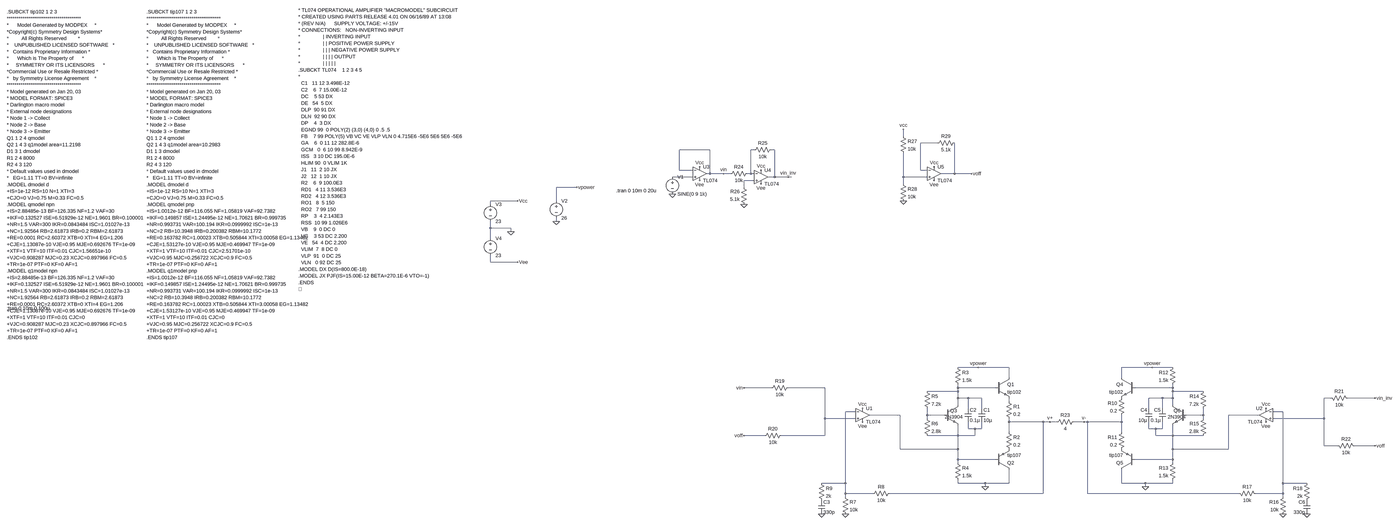
[diagram p0: schematic Draft1.asc, whole sheet]
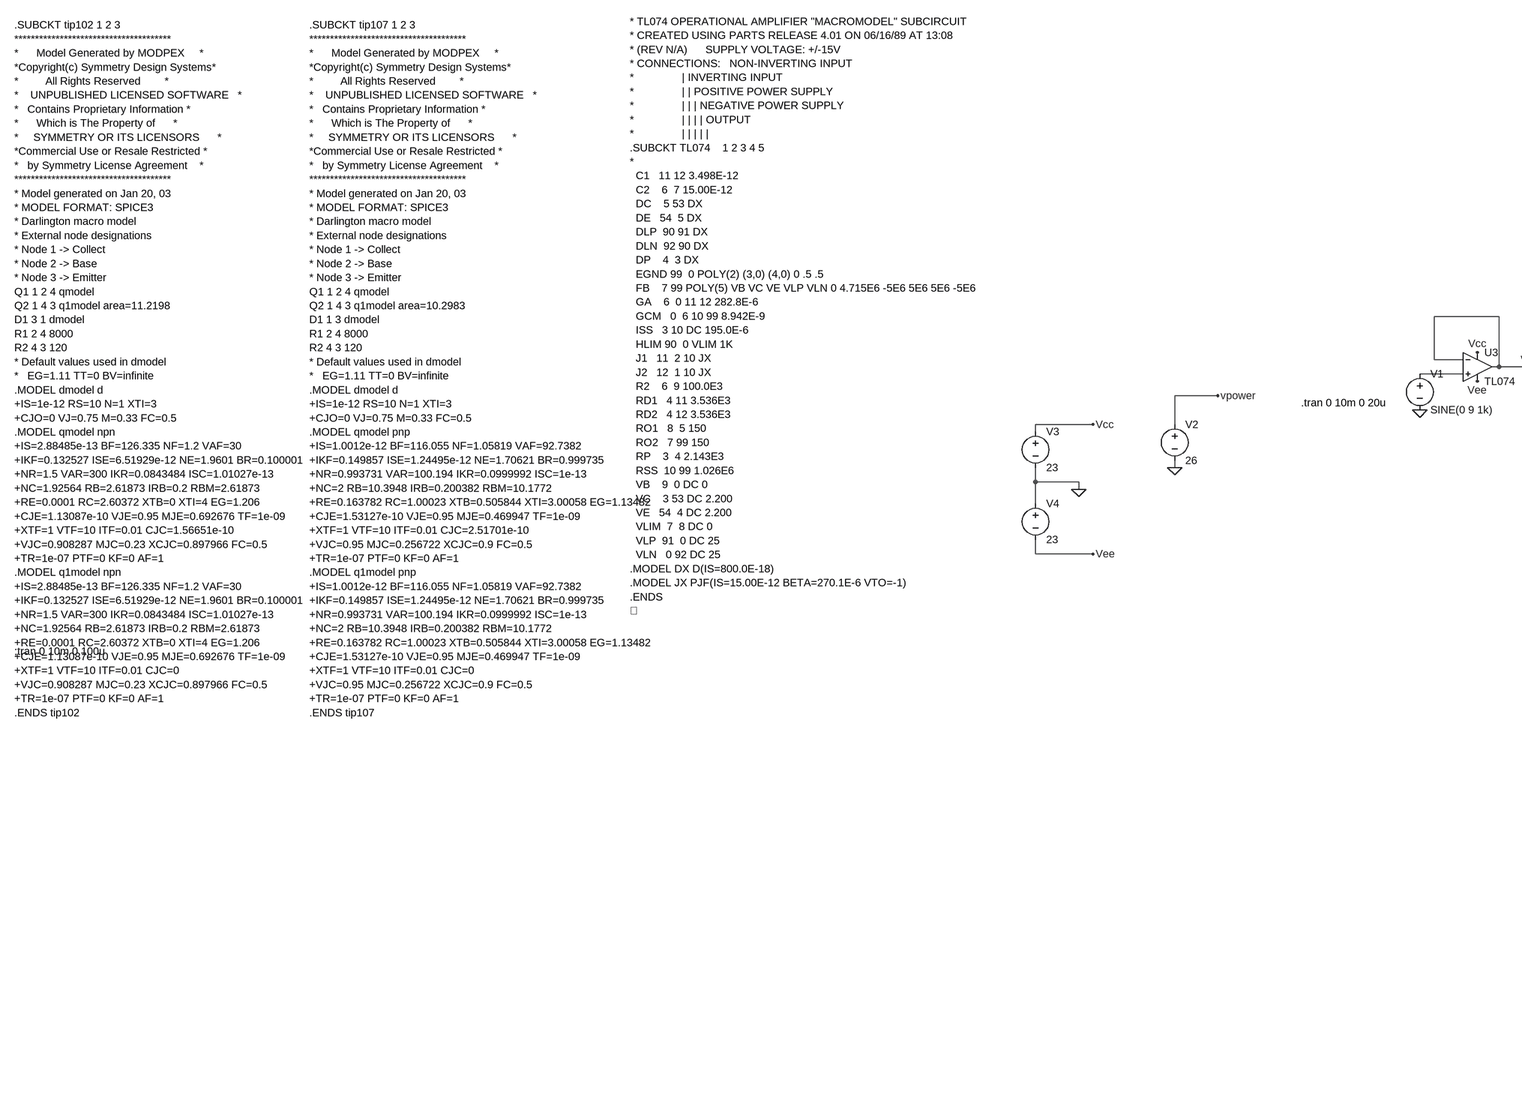
[diagram p1: schematic Draft1.asc, part, row 1 of 1, column 1 of 2]
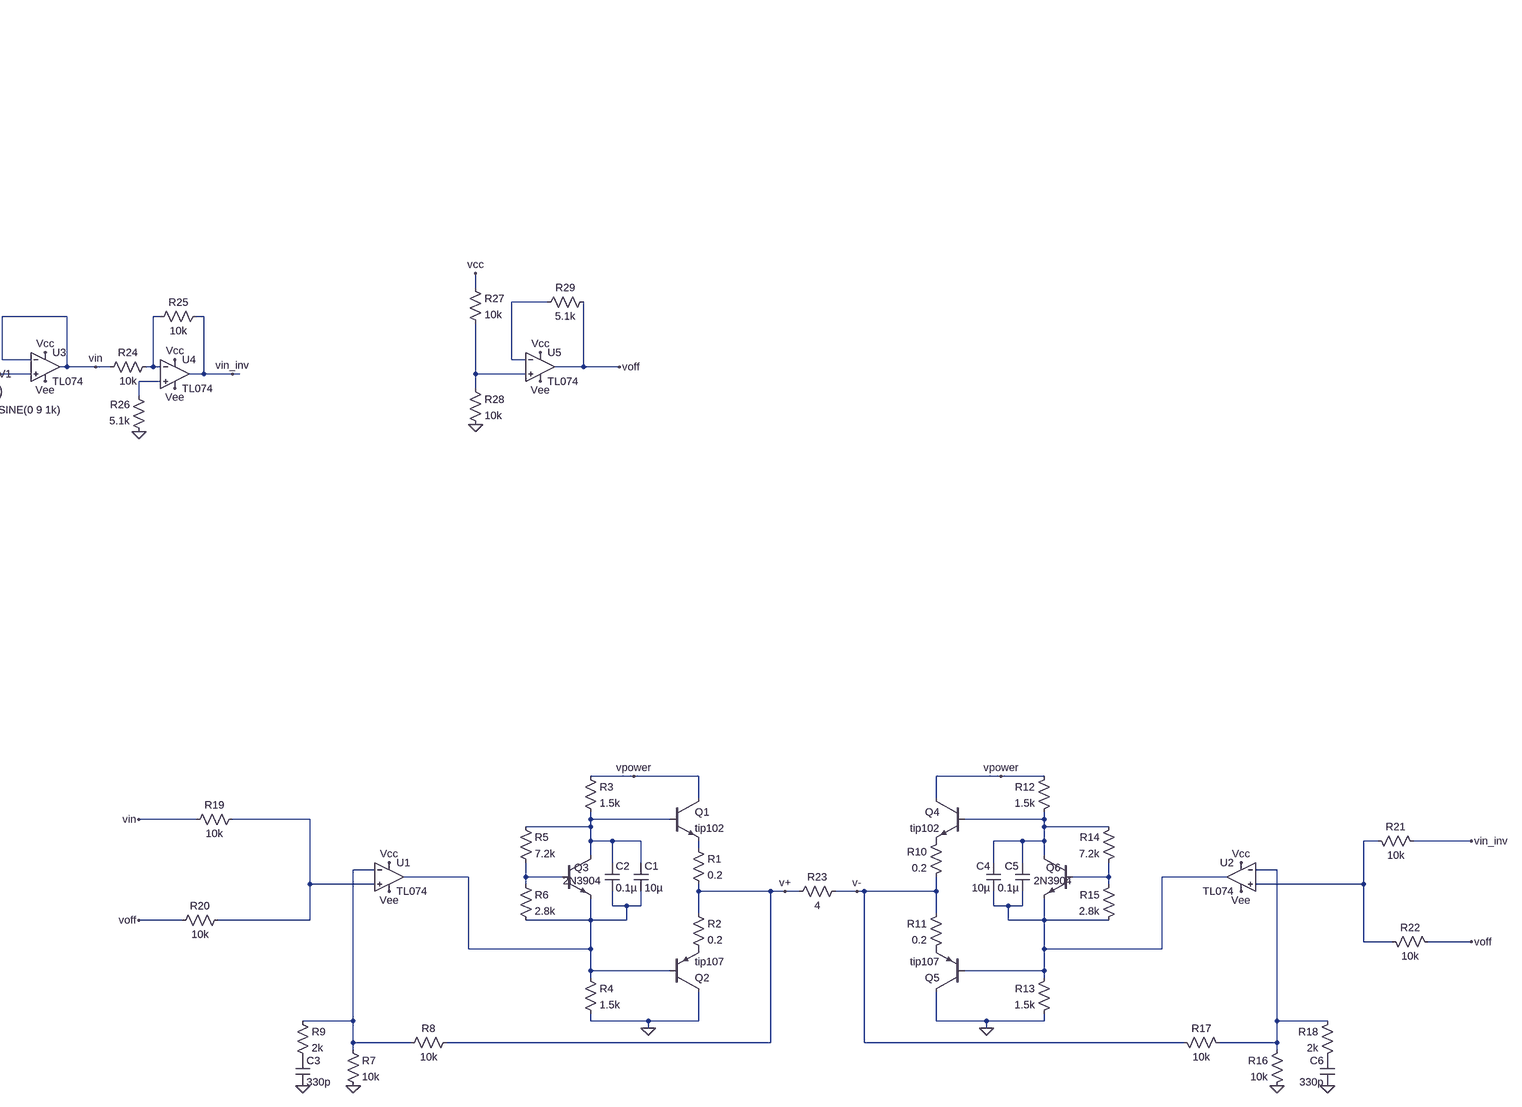
[diagram p2: schematic Draft1.asc, part, row 1 of 1, column 2 of 2]
Draft1.asc, the LTspice schematic file:
Version 4
SHEET 1 2456 680
WIRE 128 -1568 128 -1600
WIRE 288 -1536 208 -1536
WIRE -832 -1504 -976 -1504
WIRE -624 -1504 -640 -1504
WIRE -528 -1504 -544 -1504
WIRE -976 -1408 -976 -1504
WIRE -912 -1408 -976 -1408
WIRE 208 -1408 208 -1536
WIRE 240 -1408 208 -1408
WIRE -832 -1392 -832 -1504
WIRE -832 -1392 -848 -1392
WIRE -768 -1392 -832 -1392
WIRE -736 -1392 -768 -1392
WIRE -640 -1392 -640 -1504
WIRE -640 -1392 -656 -1392
WIRE -624 -1392 -640 -1392
WIRE 368 -1392 368 -1536
WIRE 368 -1392 304 -1392
WIRE 448 -1392 368 -1392
WIRE -912 -1376 -1008 -1376
WIRE -528 -1376 -528 -1504
WIRE -528 -1376 -560 -1376
WIRE -464 -1376 -528 -1376
WIRE -448 -1376 -464 -1376
WIRE 128 -1376 128 -1488
WIRE 240 -1376 128 -1376
WIRE -624 -1360 -672 -1360
WIRE 128 -1344 128 -1376
WIRE -2192 -1328 -2288 -1328
WIRE -672 -1328 -672 -1360
WIRE -2576 -1264 -2704 -1264
WIRE -2288 -1264 -2288 -1328
WIRE -2704 -1248 -2704 -1264
WIRE -2288 -1168 -2288 -1184
WIRE -2704 -1136 -2704 -1168
WIRE -2608 -1136 -2704 -1136
WIRE -2608 -1120 -2608 -1136
WIRE -2704 -1088 -2704 -1136
WIRE -2704 -976 -2704 -1008
WIRE -2576 -976 -2704 -976
WIRE 480 -432 384 -432
WIRE 624 -432 480 -432
WIRE 1296 -432 1152 -432
WIRE 1392 -432 1296 -432
WIRE 624 -384 624 -432
WIRE 1152 -384 1152 -432
WIRE -544 -336 -672 -336
WIRE -240 -336 -464 -336
WIRE 384 -336 384 -352
WIRE 560 -336 384 -336
WIRE 1392 -336 1392 -352
WIRE 1392 -336 1216 -336
WIRE 384 -320 384 -336
WIRE 384 -320 240 -320
WIRE 1392 -320 1392 -336
WIRE 1536 -320 1392 -320
WIRE 384 -288 384 -320
WIRE 432 -288 384 -288
WIRE 496 -288 432 -288
WIRE 1344 -288 1280 -288
WIRE 1392 -288 1392 -320
WIRE 1392 -288 1344 -288
WIRE 2144 -288 2112 -288
WIRE 2352 -288 2224 -288
WIRE 624 -272 624 -288
WIRE 384 -256 384 -288
WIRE 1392 -256 1392 -288
WIRE 432 -240 432 -288
WIRE 496 -240 496 -288
WIRE 1280 -240 1280 -288
WIRE 1344 -240 1344 -288
WIRE -96 -224 -144 -224
WIRE 1920 -224 1872 -224
WIRE 112 -208 -32 -208
WIRE 240 -208 240 -240
WIRE 320 -208 240 -208
WIRE 1536 -208 1536 -240
WIRE 1536 -208 1456 -208
WIRE 1808 -208 1664 -208
WIRE -240 -192 -240 -336
WIRE -96 -192 -240 -192
WIRE 240 -192 240 -208
WIRE 1536 -192 1536 -208
WIRE 2112 -192 2112 -288
WIRE 2112 -192 1872 -192
WIRE 624 -176 624 -192
WIRE 784 -176 624 -176
WIRE 816 -176 784 -176
WIRE 848 -176 816 -176
WIRE 976 -176 928 -176
WIRE 992 -176 976 -176
WIRE 1152 -176 1152 -208
WIRE 1152 -176 992 -176
WIRE 432 -144 432 -176
WIRE 464 -144 432 -144
WIRE 496 -144 496 -176
WIRE 496 -144 464 -144
WIRE 1280 -144 1280 -176
WIRE 1312 -144 1280 -144
WIRE 1344 -144 1344 -176
WIRE 1344 -144 1312 -144
WIRE 624 -128 624 -176
WIRE 1152 -128 1152 -176
WIRE -576 -112 -672 -112
WIRE -240 -112 -240 -192
WIRE -240 -112 -496 -112
WIRE 384 -112 384 -160
WIRE 384 -112 240 -112
WIRE 464 -112 464 -144
WIRE 464 -112 384 -112
WIRE 1312 -112 1312 -144
WIRE 1392 -112 1392 -160
WIRE 1392 -112 1312 -112
WIRE 1536 -112 1392 -112
WIRE 2112 -64 2112 -192
WIRE 2176 -64 2112 -64
WIRE 2352 -64 2256 -64
WIRE 112 -48 112 -208
WIRE 384 -48 384 -112
WIRE 384 -48 112 -48
WIRE 1392 -48 1392 -112
WIRE 1664 -48 1664 -208
WIRE 1664 -48 1392 -48
WIRE 384 0 384 -48
WIRE 560 0 384 0
WIRE 1392 0 1392 -48
WIRE 1392 0 1216 0
WIRE 384 16 384 0
WIRE 1392 16 1392 0
WIRE -144 112 -144 -224
WIRE -144 112 -256 112
WIRE 384 112 384 96
WIRE 512 112 384 112
WIRE 624 112 624 48
WIRE 624 112 512 112
WIRE 1152 112 1152 48
WIRE 1264 112 1152 112
WIRE 1392 112 1392 96
WIRE 1392 112 1264 112
WIRE 1920 112 1920 -224
WIRE 2032 112 1920 112
WIRE 512 128 512 112
WIRE 1264 128 1264 112
WIRE -144 160 -144 112
WIRE -16 160 -144 160
WIRE 784 160 784 -176
WIRE 784 160 64 160
WIRE 992 160 992 -176
WIRE 1712 160 992 160
WIRE 1920 160 1920 112
WIRE 1920 160 1792 160
WIRE -144 176 -144 160
WIRE 1920 176 1920 160
FLAG -64 -240 Vcc
FLAG -64 -176 Vee
FLAG -144 256 0
FLAG -256 256 0
FLAG 480 -432 vpower
FLAG 512 128 0
FLAG 1840 -240 Vcc
FLAG 1840 -176 Vee
FLAG 1920 256 0
FLAG 2032 256 0
FLAG 1296 -432 vpower
FLAG 1264 128 0
FLAG -672 -112 voff
FLAG 2352 -64 voff
FLAG 2352 -288 vin_inv
FLAG -672 -336 vin
FLAG 816 -176 v+
FLAG 976 -176 v-
FLAG -880 -1424 Vcc
FLAG -880 -1360 Vee
FLAG -592 -1408 Vcc
FLAG -592 -1344 Vee
FLAG -672 -1248 0
FLAG -768 -1392 vin
FLAG -464 -1376 vin_inv
FLAG 272 -1424 Vcc
FLAG 272 -1360 Vee
FLAG 128 -1264 0
FLAG 128 -1600 vcc
FLAG 448 -1392 voff
FLAG -1008 -1296 0
FLAG -2608 -1120 0
FLAG -2576 -1264 Vcc
FLAG -2576 -976 Vee
FLAG -2288 -1168 0
FLAG -2192 -1328 vpower
SYMBOL npn 560 -384 R0
SYMATTR InstName Q1
SYMATTR Value tip102
SYMATTR Prefix X
SYMBOL pnp 560 48 M180
SYMATTR InstName Q2
SYMATTR Value tip107
SYMATTR Prefix X
SYMBOL res 608 -288 R0
SYMATTR InstName R1
SYMATTR Value 0.2
SYMBOL res 608 -144 R0
SYMATTR InstName R2
SYMATTR Value 0.2
SYMBOL res 368 -448 R0
SYMATTR InstName R3
SYMATTR Value 1.5k
SYMBOL res 368 0 R0
SYMATTR InstName R4
SYMATTR Value 1.5k
SYMBOL OpAmps\\opamp2 -64 -272 R0
SYMATTR InstName U1
SYMATTR Value TL074
SYMBOL npn 320 -256 R0
WINDOW 0 27 27 Left 2
WINDOW 3 2 56 Left 2
SYMATTR InstName Q3
SYMATTR Value 2N3904
SYMBOL res 224 -336 R0
SYMATTR InstName R5
SYMATTR Value 7.2k
SYMBOL res 224 -208 R0
SYMATTR InstName R6
SYMATTR Value 2.8k
SYMBOL cap 480 -240 R0
SYMATTR InstName C1
SYMATTR Value 10µ
SYMBOL cap 416 -240 R0
SYMATTR InstName C2
SYMATTR Value 0.1µ
SYMBOL res -160 160 R0
SYMATTR InstName R7
SYMATTR Value 10k
SYMBOL res 80 144 R90
WINDOW 0 0 56 VBottom 2
WINDOW 3 32 56 VTop 2
SYMATTR InstName R8
SYMATTR Value 10k
SYMBOL res -272 96 R0
SYMATTR InstName R9
SYMATTR Value 2k
SYMBOL cap -272 192 R0
SYMATTR InstName C3
SYMATTR Value 330p
SYMBOL npn 1216 -384 M0
SYMATTR InstName Q4
SYMATTR Value tip102
SYMATTR Prefix X
SYMBOL pnp 1216 48 R180
SYMATTR InstName Q5
SYMATTR Value tip107
SYMATTR Prefix X
SYMBOL res 1168 -304 M0
SYMATTR InstName R10
SYMATTR Value 0.2
SYMBOL res 1168 -144 M0
SYMATTR InstName R11
SYMATTR Value 0.2
SYMBOL res 1408 -448 M0
SYMATTR InstName R12
SYMATTR Value 1.5k
SYMBOL res 1408 0 M0
SYMATTR InstName R13
SYMATTR Value 1.5k
SYMBOL OpAmps\\opamp2 1840 -272 M0
SYMATTR InstName U2
SYMATTR Value TL074
SYMBOL npn 1456 -256 M0
WINDOW 0 27 27 Left 2
WINDOW 3 2 56 Left 2
SYMATTR InstName Q6
SYMATTR Value 2N3904
SYMBOL res 1552 -336 M0
SYMATTR InstName R14
SYMATTR Value 7.2k
SYMBOL res 1552 -208 M0
SYMATTR InstName R15
SYMATTR Value 2.8k
SYMBOL cap 1296 -240 M0
SYMATTR InstName C4
SYMATTR Value 10µ
SYMBOL cap 1360 -240 M0
SYMATTR InstName C5
SYMATTR Value 0.1µ
SYMBOL res 1936 160 M0
SYMATTR InstName R16
SYMATTR Value 10k
SYMBOL res 1696 144 M90
WINDOW 0 0 56 VBottom 2
WINDOW 3 32 56 VTop 2
SYMATTR InstName R17
SYMATTR Value 10k
SYMBOL res 2048 96 M0
SYMATTR InstName R18
SYMATTR Value 2k
SYMBOL cap 2048 192 M0
SYMATTR InstName C6
SYMATTR Value 330p
SYMBOL res -448 -352 R90
WINDOW 0 0 56 VBottom 2
WINDOW 3 32 56 VTop 2
SYMATTR InstName R19
SYMATTR Value 10k
SYMBOL res -480 -128 R90
WINDOW 0 0 56 VBottom 2
WINDOW 3 32 56 VTop 2
SYMATTR InstName R20
SYMATTR Value 10k
SYMBOL res 2128 -304 M90
WINDOW 0 0 56 VBottom 2
WINDOW 3 32 56 VTop 2
SYMATTR InstName R21
SYMATTR Value 10k
SYMBOL res 2160 -80 M90
WINDOW 0 0 56 VBottom 2
WINDOW 3 32 56 VTop 2
SYMATTR InstName R22
SYMATTR Value 10k
SYMBOL res 944 -192 R90
WINDOW 0 0 56 VBottom 2
WINDOW 3 32 56 VTop 2
SYMATTR InstName R23
SYMATTR Value 4
SYMBOL OpAmps\\opamp2 -880 -1456 R0
SYMATTR InstName U3
SYMATTR Value TL074
SYMBOL OpAmps\\opamp2 -592 -1440 R0
SYMATTR InstName U4
SYMATTR Value TL074
SYMBOL res -640 -1408 R90
WINDOW 0 0 56 VBottom 2
WINDOW 3 32 56 VTop 2
SYMATTR InstName R24
SYMATTR Value 10k
SYMBOL res -528 -1520 R90
WINDOW 0 0 56 VBottom 2
WINDOW 3 32 56 VTop 2
SYMATTR InstName R25
SYMATTR Value 10k
SYMBOL res -656 -1232 R180
WINDOW 0 36 76 Left 2
WINDOW 3 36 40 Left 2
SYMATTR InstName R26
SYMATTR Value 5.1k
SYMBOL OpAmps\\opamp2 272 -1456 R0
SYMATTR InstName U5
SYMATTR Value TL074
SYMBOL res 112 -1584 R0
SYMATTR InstName R27
SYMATTR Value 10k
SYMBOL res 112 -1360 R0
SYMATTR InstName R28
SYMATTR Value 10k
SYMBOL res 384 -1552 R90
WINDOW 0 0 56 VBottom 2
WINDOW 3 32 56 VTop 2
SYMATTR InstName R29
SYMATTR Value 5.1k
SYMBOL voltage -1008 -1392 R0
WINDOW 123 0 0 Left 0
WINDOW 39 0 0 Left 0
SYMATTR InstName V1
SYMATTR Value SINE(0 9 1k)
SYMBOL voltage -2288 -1280 R0
WINDOW 123 0 0 Left 0
WINDOW 39 0 0 Left 0
SYMATTR InstName V2
SYMATTR Value 26
SYMBOL voltage -2704 -1264 R0
WINDOW 123 0 0 Left 0
WINDOW 39 0 0 Left 0
SYMATTR InstName V3
SYMATTR Value 23
SYMBOL voltage -2704 -1104 R0
WINDOW 123 0 0 Left 0
WINDOW 39 0 0 Left 0
SYMATTR InstName V4
SYMATTR Value 23
TEXT -1272 -1312 Left 2 !.tran 0 10m 0 20u
TEXT -5696 -2152 Left 2 !.SUBCKT tip102 1 2 3\n**************************************\n*      Model Generated by MODPEX     *\n*Copyright(c) Symmetry Design Systems*\n*         All Rights Reserved        *\n*    UNPUBLISHED LICENSED SOFTWARE   *\n*   Contains Proprietary Information *\n*      Which is The Property of      *\n*     SYMMETRY OR ITS LICENSORS      *\n*Commercial Use or Resale Restricted *\n*   by Symmetry License Agreement    *\n**************************************\n* Model generated on Jan 20, 03\n* MODEL FORMAT: SPICE3\n* Darlington macro model\n* External node designations\n* Node 1 -> Collect\n* Node 2 -> Base\n* Node 3 -> Emitter\nQ1 1 2 4 qmodel\nQ2 1 4 3 q1model area=11.2198\nD1 3 1 dmodel\nR1 2 4 8000\nR2 4 3 120\n* Default values used in dmodel\n*   EG=1.11 TT=0 BV=infinite\n.MODEL dmodel d\n+IS=1e-12 RS=10 N=1 XTI=3\n+CJO=0 VJ=0.75 M=0.33 FC=0.5\n.MODEL qmodel npn\n+IS=2.88485e-13 BF=126.335 NF=1.2 VAF=30\n+IKF=0.132527 ISE=6.51929e-12 NE=1.9601 BR=0.100001\n+NR=1.5 VAR=300 IKR=0.0843484 ISC=1.01027e-13\n+NC=1.92564 RB=2.61873 IRB=0.2 RBM=2.61873\n+RE=0.0001 RC=2.60372 XTB=0 XTI=4 EG=1.206\n+CJE=1.13087e-10 VJE=0.95 MJE=0.692676 TF=1e-09\n+XTF=1 VTF=10 ITF=0.01 CJC=1.56651e-10\n+VJC=0.908287 MJC=0.23 XCJC=0.897966 FC=0.5\n+TR=1e-07 PTF=0 KF=0 AF=1\n.MODEL q1model npn\n+IS=2.88485e-13 BF=126.335 NF=1.2 VAF=30\n+IKF=0.132527 ISE=6.51929e-12 NE=1.9601 BR=0.100001\n+NR=1.5 VAR=300 IKR=0.0843484 ISC=1.01027e-13\n+NC=1.92564 RB=2.61873 IRB=0.2 RBM=2.61873\n+RE=0.0001 RC=2.60372 XTB=0 XTI=4 EG=1.206\n+CJE=1.13087e-10 VJE=0.95 MJE=0.692676 TF=1e-09\n+XTF=1 VTF=10 ITF=0.01 CJC=0\n+VJC=0.908287 MJC=0.23 XCJC=0.897966 FC=0.5\n+TR=1e-07 PTF=0 KF=0 AF=1\n.ENDS tip102
TEXT -5040 -2152 Left 2 !.SUBCKT tip107 1 2 3\n**************************************\n*      Model Generated by MODPEX     *\n*Copyright(c) Symmetry Design Systems*\n*         All Rights Reserved        *\n*    UNPUBLISHED LICENSED SOFTWARE   *\n*   Contains Proprietary Information *\n*      Which is The Property of      *\n*     SYMMETRY OR ITS LICENSORS      *\n*Commercial Use or Resale Restricted *\n*   by Symmetry License Agreement    *\n**************************************\n* Model generated on Jan 20, 03\n* MODEL FORMAT: SPICE3\n* Darlington macro model\n* External node designations\n* Node 1 -> Collect\n* Node 2 -> Base\n* Node 3 -> Emitter\nQ1 1 2 4 qmodel\nQ2 1 4 3 q1model area=10.2983\nD1 1 3 dmodel\nR1 2 4 8000\nR2 4 3 120\n* Default values used in dmodel\n*   EG=1.11 TT=0 BV=infinite\n.MODEL dmodel d\n+IS=1e-12 RS=10 N=1 XTI=3\n+CJO=0 VJ=0.75 M=0.33 FC=0.5\n.MODEL qmodel pnp\n+IS=1.0012e-12 BF=116.055 NF=1.05819 VAF=92.7382\n+IKF=0.149857 ISE=1.24495e-12 NE=1.70621 BR=0.999735\n+NR=0.993731 VAR=100.194 IKR=0.0999992 ISC=1e-13\n+NC=2 RB=10.3948 IRB=0.200382 RBM=10.1772\n+RE=0.163782 RC=1.00023 XTB=0.505844 XTI=3.00058 EG=1.13482\n+CJE=1.53127e-10 VJE=0.95 MJE=0.469947 TF=1e-09\n+XTF=1 VTF=10 ITF=0.01 CJC=2.51701e-10\n+VJC=0.95 MJC=0.256722 XCJC=0.9 FC=0.5\n+TR=1e-07 PTF=0 KF=0 AF=1\n.MODEL q1model pnp\n+IS=1.0012e-12 BF=116.055 NF=1.05819 VAF=92.7382\n+IKF=0.149857 ISE=1.24495e-12 NE=1.70621 BR=0.999735\n+NR=0.993731 VAR=100.194 IKR=0.0999992 ISC=1e-13\n+NC=2 RB=10.3948 IRB=0.200382 RBM=10.1772\n+RE=0.163782 RC=1.00023 XTB=0.505844 XTI=3.00058 EG=1.13482\n+CJE=1.53127e-10 VJE=0.95 MJE=0.469947 TF=1e-09\n+XTF=1 VTF=10 ITF=0.01 CJC=0\n+VJC=0.95 MJC=0.256722 XCJC=0.9 FC=0.5\n+TR=1e-07 PTF=0 KF=0 AF=1\n.ENDS tip107
TEXT -5696 -760 Left 2 !;tran 0 10m 0 100u
TEXT -4328 -2160 Left 2 !* TL074 OPERATIONAL AMPLIFIER "MACROMODEL" SUBCIRCUIT\n* CREATED USING PARTS RELEASE 4.01 ON 06/16/89 AT 13:08\n* (REV N/A)      SUPPLY VOLTAGE: +/-15V\n* CONNECTIONS:   NON-INVERTING INPUT\n*                | INVERTING INPUT\n*                | | POSITIVE POWER SUPPLY\n*                | | | NEGATIVE POWER SUPPLY\n*                | | | | OUTPUT\n*                | | | | |\n.SUBCKT TL074    1 2 3 4 5\n*\n  C1   11 12 3.498E-12\n  C2    6  7 15.00E-12\n  DC    5 53 DX\n  DE   54  5 DX\n  DLP  90 91 DX\n  DLN  92 90 DX\n  DP    4  3 DX\n  EGND 99  0 POLY(2) (3,0) (4,0) 0 .5 .5\n  FB    7 99 POLY(5) VB VC VE VLP VLN 0 4.715E6 -5E6 5E6 5E6 -5E6\n  GA    6  0 11 12 282.8E-6\n  GCM   0  6 10 99 8.942E-9\n  ISS   3 10 DC 195.0E-6\n  HLIM 90  0 VLIM 1K\n  J1   11  2 10 JX\n  J2   12  1 10 JX\n  R2    6  9 100.0E3\n  RD1   4 11 3.536E3\n  RD2   4 12 3.536E3\n  RO1   8  5 150\n  RO2   7 99 150\n  RP    3  4 2.143E3\n  RSS  10 99 1.026E6\n  VB    9  0 DC 0\n  VC    3 53 DC 2.200\n  VE   54  4 DC 2.200\n  VLIM  7  8 DC 0\n  VLP  91  0 DC 25\n  VLN   0 92 DC 25\n.MODEL DX D(IS=800.0E-18)\n.MODEL JX PJF(IS=15.00E-12 BETA=270.1E-6 VTO=-1)\n.ENDS\n

The netlist it stands for:
* Draft1.asc
XQ1 vpower N007 N010 tip102  ; pins C B E
XQ2 0 N013 P001 tip107  ; pins C B E
R1 N010 v+ 0.2
R2 v+ P001 0.2
R3 vpower N007 1.5k
R4 N013 0 1.5k
XU1 N006 N011 Vcc Vee N013 TL074  ; pins In+ In- V+ V- OUT
Q3 N007 N014 N013 0 2N3904
R5 N007 N014 7.2k
R6 N014 N013 2.8k
C1 N007 N013 10µ
C2 N007 N013 0.1µ
R7 N011 0 10k
R8 v+ N011 10k
R9 N011 P002 2k
C3 P002 0 330p
XQ4 vpower N008 P003 tip102  ; pins C B E
XQ5 0 N016 P004 tip107  ; pins C B E
R10 P003 v- 0.2
R11 v- P004 0.2
R12 vpower N008 1.5k
R13 N016 0 1.5k
XU2 N009 N012 Vcc Vee N016 TL074  ; pins In+ In- V+ V- OUT
Q6 N008 N015 N016 0 2N3904
R14 N008 N015 7.2k
R15 N015 N016 2.8k
C4 N008 N016 10µ
C5 N008 N016 0.1µ
R16 N012 0 10k
R17 v- N012 10k
R18 N012 P005 2k
C6 P005 0 330p
R19 N006 vin 10k
R20 N006 voff 10k
R21 N009 vin_inv 10k
R22 N009 voff 10k
R23 v- v+ 4
XU3 N003 vin Vcc Vee vin TL074  ; pins In+ In- V+ V- OUT
XU4 N005 N002 Vcc Vee vin_inv TL074  ; pins In+ In- V+ V- OUT
R24 N002 vin 10k
R25 vin_inv N002 10k
R26 0 N005 5.1k
XU5 N004 N001 Vcc Vee voff TL074  ; pins In+ In- V+ V- OUT
R27 Vcc N004 10k
R28 N004 0 10k
R29 voff N001 5.1k
V1 N003 0 SINE(0 9 1k)
V2 vpower 0 26
V3 Vcc 0 23
V4 0 Vee 23
.model NPN NPN
.model PNP PNP
.lib standard.bjt
.tran 0 10m 0 20u
.SUBCKT tip102 1 2 3
**************************************
*      Model Generated by MODPEX     *
*Copyright(c) Symmetry Design Systems*
*         All Rights Reserved        *
*    UNPUBLISHED LICENSED SOFTWARE   *
*   Contains Proprietary Information *
*      Which is The Property of      *
*     SYMMETRY OR ITS LICENSORS      *
*Commercial Use or Resale Restricted *
*   by Symmetry License Agreement    *
**************************************
* Model generated on Jan 20, 03
* MODEL FORMAT: SPICE3
* Darlington macro model
* External node designations
* Node 1 -> Collect
* Node 2 -> Base
* Node 3 -> Emitter
Q1 1 2 4 qmodel
Q2 1 4 3 q1model area=11.2198
D1 3 1 dmodel
R1 2 4 8000
R2 4 3 120
* Default values used in dmodel
*   EG=1.11 TT=0 BV=infinite
.MODEL dmodel d
+IS=1e-12 RS=10 N=1 XTI=3
+CJO=0 VJ=0.75 M=0.33 FC=0.5
.MODEL qmodel npn
+IS=2.88485e-13 BF=126.335 NF=1.2 VAF=30
+IKF=0.132527 ISE=6.51929e-12 NE=1.9601 BR=0.100001
+NR=1.5 VAR=300 IKR=0.0843484 ISC=1.01027e-13
+NC=1.92564 RB=2.61873 IRB=0.2 RBM=2.61873
+RE=0.0001 RC=2.60372 XTB=0 XTI=4 EG=1.206
+CJE=1.13087e-10 VJE=0.95 MJE=0.692676 TF=1e-09
+XTF=1 VTF=10 ITF=0.01 CJC=1.56651e-10
+VJC=0.908287 MJC=0.23 XCJC=0.897966 FC=0.5
+TR=1e-07 PTF=0 KF=0 AF=1
.MODEL q1model npn
+IS=2.88485e-13 BF=126.335 NF=1.2 VAF=30
+IKF=0.132527 ISE=6.51929e-12 NE=1.9601 BR=0.100001
+NR=1.5 VAR=300 IKR=0.0843484 ISC=1.01027e-13
+NC=1.92564 RB=2.61873 IRB=0.2 RBM=2.61873
+RE=0.0001 RC=2.60372 XTB=0 XTI=4 EG=1.206
+CJE=1.13087e-10 VJE=0.95 MJE=0.692676 TF=1e-09
+XTF=1 VTF=10 ITF=0.01 CJC=0
+VJC=0.908287 MJC=0.23 XCJC=0.897966 FC=0.5
+TR=1e-07 PTF=0 KF=0 AF=1
.ENDS tip102
.SUBCKT tip107 1 2 3
**************************************
*      Model Generated by MODPEX     *
*Copyright(c) Symmetry Design Systems*
*         All Rights Reserved        *
*    UNPUBLISHED LICENSED SOFTWARE   *
*   Contains Proprietary Information *
*      Which is The Property of      *
*     SYMMETRY OR ITS LICENSORS      *
*Commercial Use or Resale Restricted *
*   by Symmetry License Agreement    *
**************************************
* Model generated on Jan 20, 03
* MODEL FORMAT: SPICE3
* Darlington macro model
* External node designations
* Node 1 -> Collect
* Node 2 -> Base
* Node 3 -> Emitter
Q1 1 2 4 qmodel
Q2 1 4 3 q1model area=10.2983
D1 1 3 dmodel
R1 2 4 8000
R2 4 3 120
* Default values used in dmodel
*   EG=1.11 TT=0 BV=infinite
.MODEL dmodel d
+IS=1e-12 RS=10 N=1 XTI=3
+CJO=0 VJ=0.75 M=0.33 FC=0.5
.MODEL qmodel pnp
+IS=1.0012e-12 BF=116.055 NF=1.05819 VAF=92.7382
+IKF=0.149857 ISE=1.24495e-12 NE=1.70621 BR=0.999735
+NR=0.993731 VAR=100.194 IKR=0.0999992 ISC=1e-13
+NC=2 RB=10.3948 IRB=0.200382 RBM=10.1772
+RE=0.163782 RC=1.00023 XTB=0.505844 XTI=3.00058 EG=1.13482
+CJE=1.53127e-10 VJE=0.95 MJE=0.469947 TF=1e-09
+XTF=1 VTF=10 ITF=0.01 CJC=2.51701e-10
+VJC=0.95 MJC=0.256722 XCJC=0.9 FC=0.5
+TR=1e-07 PTF=0 KF=0 AF=1
.MODEL q1model pnp
+IS=1.0012e-12 BF=116.055 NF=1.05819 VAF=92.7382
+IKF=0.149857 ISE=1.24495e-12 NE=1.70621 BR=0.999735
+NR=0.993731 VAR=100.194 IKR=0.0999992 ISC=1e-13
+NC=2 RB=10.3948 IRB=0.200382 RBM=10.1772
+RE=0.163782 RC=1.00023 XTB=0.505844 XTI=3.00058 EG=1.13482
+CJE=1.53127e-10 VJE=0.95 MJE=0.469947 TF=1e-09
+XTF=1 VTF=10 ITF=0.01 CJC=0
+VJC=0.95 MJC=0.256722 XCJC=0.9 FC=0.5
+TR=1e-07 PTF=0 KF=0 AF=1
.ENDS tip107
;tran 0 10m 0 100u
* TL074 OPERATIONAL AMPLIFIER "MACROMODEL" SUBCIRCUIT
* CREATED USING PARTS RELEASE 4.01 ON 06/16/89 AT 13:08
* (REV N/A)      SUPPLY VOLTAGE: +/-15V
* CONNECTIONS:   NON-INVERTING INPUT
*                | INVERTING INPUT
*                | | POSITIVE POWER SUPPLY
*                | | | NEGATIVE POWER SUPPLY
*                | | | | OUTPUT
*                | | | | |
.SUBCKT TL074    1 2 3 4 5
*
  C1   11 12 3.498E-12
  C2    6  7 15.00E-12
  DC    5 53 DX
  DE   54  5 DX
  DLP  90 91 DX
  DLN  92 90 DX
  DP    4  3 DX
  EGND 99  0 POLY(2) (3,0) (4,0) 0 .5 .5
  FB    7 99 POLY(5) VB VC VE VLP VLN 0 4.715E6 -5E6 5E6 5E6 -5E6
  GA    6  0 11 12 282.8E-6
  GCM   0  6 10 99 8.942E-9
  ISS   3 10 DC 195.0E-6
  HLIM 90  0 VLIM 1K
  J1   11  2 10 JX
  J2   12  1 10 JX
  R2    6  9 100.0E3
  RD1   4 11 3.536E3
  RD2   4 12 3.536E3
  RO1   8  5 150
  RO2   7 99 150
  RP    3  4 2.143E3
  RSS  10 99 1.026E6
  VB    9  0 DC 0
  VC    3 53 DC 2.200
  VE   54  4 DC 2.200
  VLIM  7  8 DC 0
  VLP  91  0 DC 25
  VLN   0 92 DC 25
.MODEL DX D(IS=800.0E-18)
.MODEL JX PJF(IS=15.00E-12 BETA=270.1E-6 VTO=-1)
.ENDS

.backanno
.end